# EAGLE schematic transistor_current_source (EAGLE 6.4)
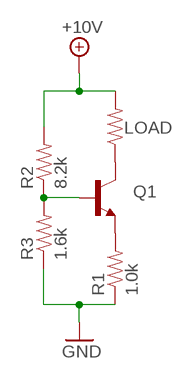
[diagram p0: schematic, sheet 1]

## Parts
LOAD  RESISTOR0402-RES  [0402-RES]
Q1  TRANSISTOR_NPN"  [SOT223]
R1  1.0k  RESISTOR0402-RES  [0402-RES]
R2  8.2k  RESISTOR0402-RES  [0402-RES]
R3  1.6k  RESISTOR0402-RES  [0402-RES]

## Nets
+10V: LOAD.2 R2.2
GND: R1.1 R3.1
N$1: Q1.3(E) R1.2
N$2: Q1.1(B) R2.1 R3.2
N$3: LOAD.1 Q1.2(C)

## Library data of the parts
LOAD R1-R3 = SparkFun-Resistors:RESISTOR: Resistor Basic schematic elements and footprints for 0603, 1206, and PTH resistors.
Q1 = SparkFun-DiscreteSemi:TRANSISTOR_NPN: Generic NPN BJT. MMBT2222 is the common NPN we use. Double check against datasheet- not all devices are the same!